# Altium schematic sheet UPS.SchDoc
size A4
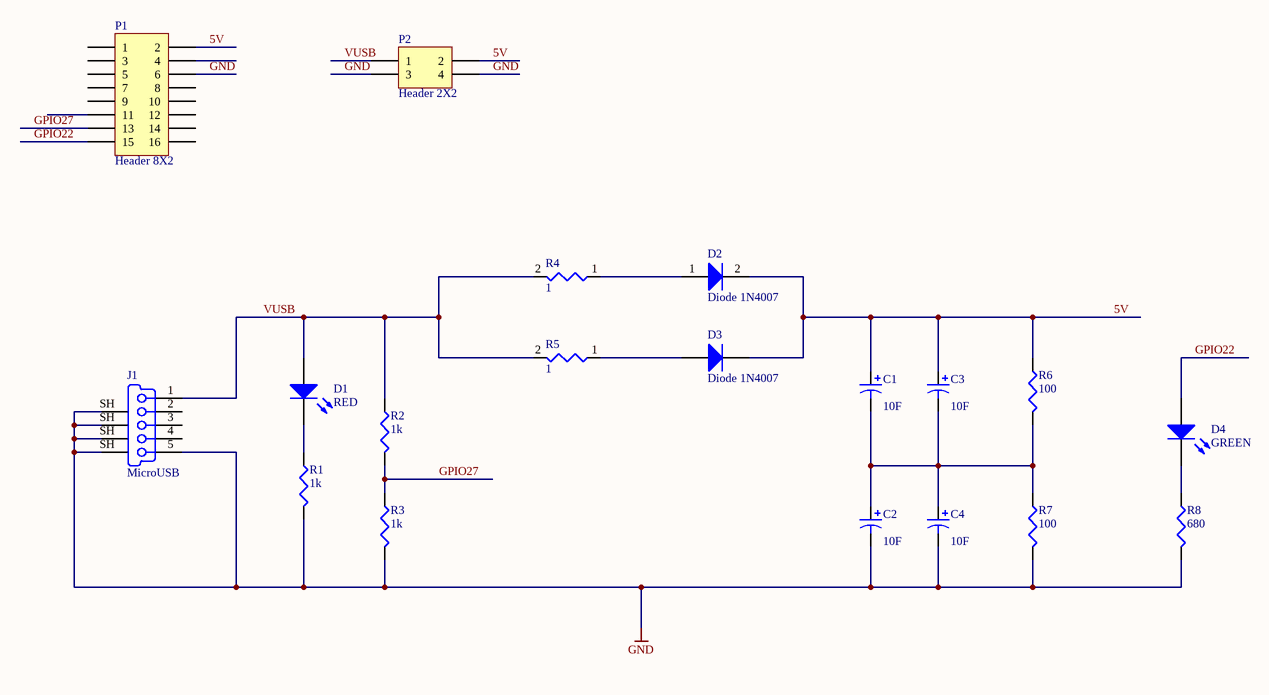
[diagram p0: UPS.SchDoc]

## Parts
C1  value 10F  [CAPE5.0mm]  (hidden comment: Cap Pol1)
C2  value 10F  [CAPE5.0mm]  (hidden comment: Cap Pol1)
C3  value 10F  [CAPE5.0mm]  (hidden comment: Cap Pol1)
C4  value 10F  [CAPE5.0mm]  (hidden comment: Cap Pol1)
D1  RED  [LED_3mm]
D2  Diode 1N4007  [DO-41]
D3  Diode 1N4007  [DO-41]
D4  GREEN  [LED_3mm]
J1  MicroUSB  [USB_Micro-B_FCI_SMD]
P1  Header 8X2  [HDR2X8]
P2  Header 2X2  [HDR2X2]
R1  value 1k  [RESTH_0.0R_AXIAL-0.6]  (hidden comment: Res3)
R2  value 1k  [RESTH_0.0R_AXIAL-0.6]  (hidden comment: Res3)
R3  value 1k  [RESTH_0.0R_AXIAL-0.6]  (hidden comment: Res3)
R4  value 1  [RESTH_AXIAL_MRA-12]  (hidden comment: Res3)
R5  value 1  [RESTH_AXIAL_MRA-12]  (hidden comment: Res3)
R6  value 100  [RESTH_0.0R_AXIAL-0.6]  (hidden comment: Res3)
R7  value 100  [RESTH_0.0R_AXIAL-0.6]  (hidden comment: Res3)
R8  value 680  [RESTH_0.0R_AXIAL-0.6]  (hidden comment: Res3)

## Nets
GND: C2.2 C4.2 J1.5(GND) J1.SH(Tab) P1.6 P2.3 P2.4 R1.2 R3.2 R7.2 R8.2
5V: C1.1 C3.1 D2.2 D3.2 P1.2 P2.2 R6.1
GPIO22: D4.1(A) P1.15
GPIO27: P1.13 R2.2 R3.1
VUSB: D1.1(A) J1.1(V_BUS_(5V)) P2.1 R2.1 R4.2 R5.2
NetC1_2: C1.2 C2.1 C3.2 C4.1 R6.2 R7.1
NetD1_2: D1.2(K) R1.1
NetD2_1: D2.1 R4.1
NetD3_1: D3.1 R5.1
NetD4_2: D4.2(K) R8.1

Not connected (* = marked no-connect by the designer): J1 2(D-) 3(D+) 4(NC); P1 1 3 4 5 7 8 9 10 11 12 14 16

## Library data of the parts
C1-C4 = Cap Pol1: Polarized Capacitor (Radial); Published: 8-Jun-2000; LatestRevisionDate: 17-Jul-2002; LatestRevisionNote: Re-released for DXP Platform.; PackageReference: RB7.6-15; Publisher: Altium Limited; PackageDescription: Polarized Capacitor (Radial); 2 Leads
D1 D4 = LED0: Typical INFRARED GaAs LED; pin to pad: 1>A 2>K; Published: 8-Jun-2000; LatestRevisionDate: 08-Jul-2005; LatestRevisionNote: Mech Layer 1 removed.; PackageReference: LED-0; Publisher: Altium Limited; PackageDescription: LED; 2 Leads
D2 D3 = Diode 1N4007: 1 Amp General Purpose Rectifier; pin to pad: 1>A 2>K; Published: 8-Jun-2000; LatestRevisionDate: 17-Jul-2002; LatestRevisionNote: Re-released for DXP Platform.; DatasheetVersion: 1998; PackageVersion: Aug-1999; PackageReference: DO-41; Publisher: Altium Limited; PackageDescription: Diode, Axial; Body 5.2 x 2.7 mm (LxDia. max), Lead Dia. 0.86 mm (max); Code_JEDEC: DO-204-AL; ComponentLink1Description: Manufacturer Link; ComponentLink1URL: http://www.fairchildsemi.com/; ComponentLink2Description: Datasheet; ComponentLink2URL: http://www.fairchildsemi.com/ds/1N%2F1N4001.pdf
J1 = MicroUSB: USB On-The-Go (OTG) Mini-B Receptacle, Right Angle, SMT, 0.80mm (.031") Pitch, Solder Tabs with Back Cover, Recessed Type; PCB_Layout: Complies with Manufacturer's Recommendation.; Published: 21-Sep-2007; DatasheetVersion: revA, May-2004; PackageVersion: May-2004; PackageReference: 481900001; Publisher: Altium Limited; PackageDescription: USB Mini-B, Sinking Type, SM; 5 Position; Right Angle, Body 11.45 x 11.8 x 3.9 mm (LxWxH); ComponentLink1Description: Manufacturer Link; ComponentLink1URL: http://www.molex.com/; ComponentLink2Description: Datasheet; ComponentLink2URL: http://www.molex.com/cmc_upload/0/000/895/958/SD-48190-001RevA.pdf
P1 = Header 8X2: Header, 8-Pin, Dual row; LatestRevisionDate: 17-Jul-2002; LatestRevisionNote: Re-released for DXP Platform.; Publisher: Altium Limited
P2 = Header 2X2: Header, 2-Pin, Dual row; LatestRevisionDate: 17-Jul-2002; LatestRevisionNote: Re-released for DXP Platform.; Publisher: Altium Limited
R1-R8 = Res3: Resistor; Published: 8-Jun-2000; LatestRevisionDate: 29-May-2009; LatestRevisionNote: IPC-7351 Footprint Added.; PackageReference: J1-0603; Publisher: Altium Limited; PackageDescription: Chip Resistor